# EAGLE design TA_v2_ESP (EAGLE 9.6.2)
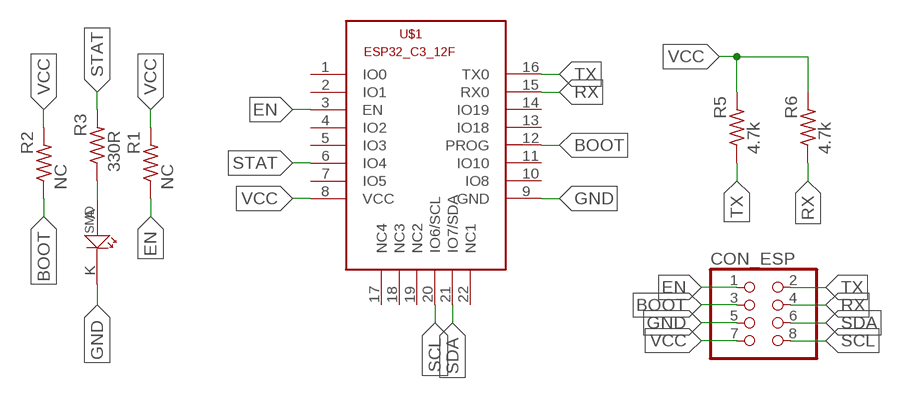
[diagram p0: schematic, sheet 1]

## Parts
CON_ESP  PINHD-2X4  [2X04]
R1  NC  R-US_R0603  [R0603]
R2  NC  R-US_R0603  [R0603]
R3  330R  R-US_R0603  [R0603]
R5  4.7k  R-US_R0603  [R0603]
R6  4.7k  R-US_R0603  [R0603]
U$1  ESP32-C3-12FESP32-C3-12F  [ESP32-C3-12F]
U$3  LED_SMD  [LED_0603]

## Nets
BOOT: CON_ESP.3 R2.1 U$1.12(PROG)
EN: CON_ESP.1 R1.1 U$1.3(EN)
GND: CON_ESP.5 U$1.9(GND) U$3.K
N$7: R3.1 U$3.A
RX: CON_ESP.4 R6.1 U$1.15(RX0)
SCL: CON_ESP.8 U$1.20(IO6/SCL)
SDA: CON_ESP.6 U$1.21(IO7/SDA)
STAT: R3.2 U$1.6(IO4)
TX: CON_ESP.2 R5.1 U$1.16(TX0)
VCC: CON_ESP.7 R1.2 R2.2 R5.2 R6.2 U$1.8(VCC)
Unconnected: U$1.1(IO0) U$1.2(IO1) U$1.4(IO2) U$1.5(IO3) U$1.7(IO5) U$1.10(IO8) U$1.11(IO10) U$1.13(IO18) U$1.14(IO19) U$1.17(NC4) U$1.18(NC3) U$1.19(NC2) U$1.22(NC1)

## Library data of the parts
CON_ESP = pinhead:PINHD-2X4: PIN HEADER
R1-R3 R5 R6 = rcl:R-US_: RESISTOR, American symbol; SPICEPREFIX: R
U$1 = ESP32-C3-12F:ESP32-C3-12F: ESP32-C3-12F Created by Egar Pambudi
U$3 = LED_SMD:LED_SMD

## Board
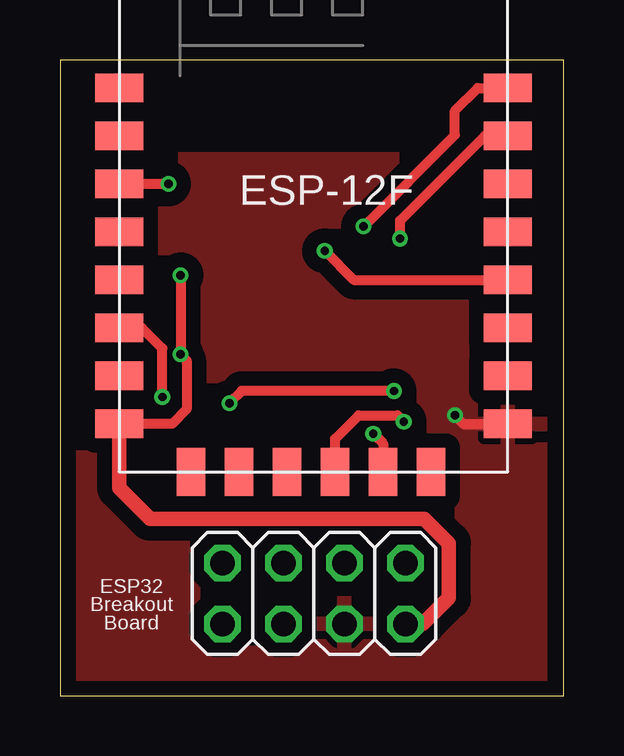
[diagram p1: board, top side]
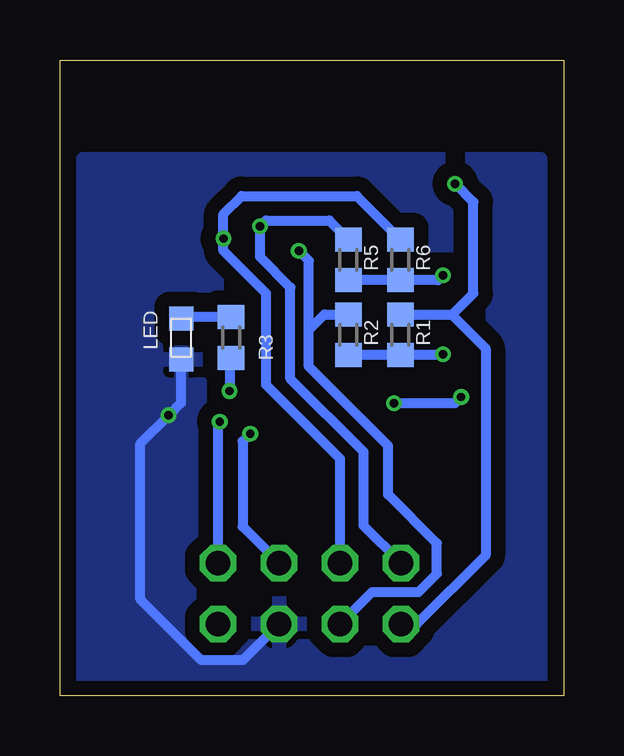
[diagram p2: board, bottom side, seen from below]

Size 20.98 x 26.5 mm. Coordinates in mm from the lower left corner, seen from the top.
Outline: 0,0 20.98,0 20.98,26.5 0,26.5 0,0
Copper layers (1*16): Top 0.035mm / dielectric 1.6mm / Bottom 0.035mm
Design rules "Elecrow_2-layer_PCB_eagle_rule": minimum track width 6mil, minimum drill 12mil, track to track 6mil, track to pad 6mil, pad to pad 6mil, via to via 8mil, smd to smd 0mil, copper to edge 20mil, drill to drill 10mil, minimum pad ring 6mil, minimum via ring 6mil, stop-mask expansion 0mil, vias tented up to drill 100mil, thermal gap 10mil

### Footprints (pad centres in the part's own frame; a part is rotated, then mirrored left to right if it is on the bottom)
2X04 = drill 1.016 octagon: 1 -3.81,-1.27; 2 -3.81,1.27; 3 -1.27,-1.27; 4 -1.27,1.27; 5 1.27,-1.27; 6 1.27,1.27; 7 3.81,-1.27; 8 3.81,1.27
R0603 = smd 1 x 1.1: 1 -0.85,0; 2 0.85,0
ESP32-C3-12F = smd 2 x 1.2: 1 -7.62,5.84; 2 -7.62,3.84; 3 -7.62,1.84; 4 -7.62,-0.16; 5 -7.62,-2.16; 6 -7.62,-4.16; 7 -7.62,-6.16; 8 -7.62,-8.16; 9 8.58,-8.16; 10 8.58,-6.16; 11 8.58,-4.16; 12 8.58,-2.16; 13 8.58,-0.16; 14 8.58,1.84; 15 8.58,3.84; 16 8.58,5.84 | smd 1.2 x 2: 17 -4.62,-10.16; 18 -2.62,-10.16; 19 -0.62,-10.16; 20 1.38,-10.16; 21 3.38,-10.16; 22 5.38,-10.16
LED_0603 = smd 1 x 1: A -0.8,0; K 0.9,0

### Placement (x,y rotation side)
CON_ESP  10.58,4.25 0 top
R1  6.8,15.04 270 bottom
R2  8.96,15.04 270 bottom
R3  13.85,14.93 270 bottom
R5  8.96,18.17 270 bottom
R6  6.8,18.17 270 bottom
U$1  10.08,19.49 0 top
U$3  15.94,14.92 270 bottom

### Tracks (layer width: path | path; a pad name or v marks a point on that pad's centre or on a via)
BOOT  (via drill 0.35)
  Top 0.406: v11.03,18.54 12.24,17.33 U$1.12
  Bottom 0.406: CON_ESP.3 7.98,4.32 6.04,4.32 5.28,5.08 5.28,6.35 7.31,8.38 7.31,10.41 10.61,13.72 10.61,15.24 | R2.1 9.96,15.89 10.61,15.24 | 10.61,15.24 10.61,18.13 v11.03,18.54
EN  (via drill 0.35)
  Top 0.406: v4.52,21.34 v4.51,21.33 U$1.3
  Bottom 0.406: R1.1 4.66,15.89 | 4.66,15.89 4.63,15.89 3.76,16.76 3.76,20.57 v4.52,21.34 | 4.66,15.89 3.25,14.48 3.25,5.84 6.11,2.98 CON_ESP.1
GND  (via drill 0.35)
  Top 0.406: v16.46,11.68 16.81,11.33 U$1.9
  Bottom 0.406: CON_ESP.5 13.36,1.47 15.09,1.47 17.63,4.01 17.63,10.51 v16.46,11.68 15.95,12.19 U$3.K
  pour Top (isolate 0.61): 0.96,22.36 20.01,22.36 20.01,0.51 0.96,0.51
  pour Bottom (isolate 0.61, rank 4): 0.96,22.36 20.01,22.36 20.01,0.51 0.96,0.51
N$7
  Bottom 0.406: R3.1 15.88,15.78 U$3.A
RX  (via drill 0.35)
  Top 0.406: v14.17,19.05 14.17,19.81 17.69,23.33 U$1.15
  Bottom 0.406: CON_ESP.4 9.31,9.87 12.39,12.95 12.39,16.76 14.17,18.54 v14.17,19.05 14.17,20.07 13.41,20.83 8.61,20.83 R6.1
SCL  (via drill 0.35)
  Top 0.406: U$1.20 11.46,10.7 12.45,11.68 14.06,11.68 v14.32,11.42
  Bottom 0.406: CON_ESP.8 14.39,11.36 v14.32,11.42
SDA  (via drill 0.35)
  Top 0.406: v13.05,10.91 13.46,10.51 U$1.21
  Bottom 0.406: CON_ESP.6 13.37,7.05 13.37,10.59 v13.05,10.91
STAT  (via drill 0.35)
  Top 0.406: v13.92,12.7 7.57,12.7 v7.06,12.19 | v4.26,12.45 4.26,14.48 3.41,15.33 U$1.6
  Bottom 0.406: R3.2 13.92,14.02 v13.92,12.7 | v7.06,12.19 4.52,12.19 v4.26,12.45
TX  (via drill 0.35)
  Top 0.406: v12.65,19.56 16.46,23.37 16.46,24.38 17.4,25.33 U$1.16
  Bottom 0.406: CON_ESP.2 8.33,7.08 8.33,10.16 11.38,13.21 11.38,17.02 12.65,18.29 v12.65,19.56 12.39,19.81 9.76,19.81 R5.1
VCC  (via drill 0.35)
  Top 0.406: v5.03,17.53 v5.03,14.22 5.28,13.97 5.28,11.94 4.67,11.33 U$1.8
  Top 0.61: CON_ESP.7 15.12,2.98 16.2,4.06 16.2,6.35 15.19,7.37 3.76,7.37 2.46,8.66 U$1.8
  Bottom 0.406: v5.03,14.22 5.06,14.19 R1.2 R2.2 | v5.03,17.53 5.24,17.32 R6.2 R5.2

### Text on the board
tNames: ESP32 / Breakout / Board
bNames: LED